# EAGLE design Sensore di allagamento (EAGLE 7.6.0)
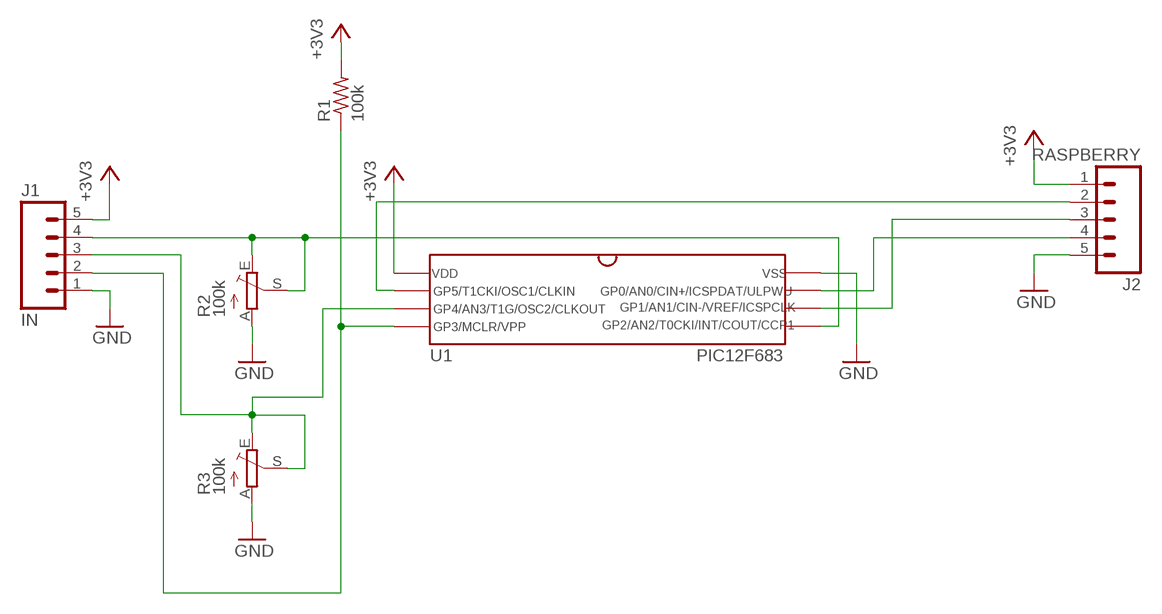
[diagram p0: schematic, sheet 1]

## Parts
J1  IN  M05JST-VERT  [JST-5-PTH-VERT]
J2  RASPBERRY  M05PTH  [1X05]
R1  100k  R-US_0207/15  [0207/15]
R2  100k  TRIM_EU-CA9V  [CA9V]
R3  100k  TRIM_EU-CA9V  [CA9V]
U1  PIC12F683_RPDIP  [RPDIP-8PIN]

## Nets
+3V3: J1.5 J2.1 R1.2 U1.P$1
GND: J1.1 J2.5 R2.A R3.A U1.P$8
N$1: J1.4 R2.E R2.S U1.P$5
N$2: J2.4 U1.P$7
N$3: J2.2 U1.P$2
N$4: J2.3 U1.P$6
N$5: J1.2 R1.1 U1.P$4
N$6: J1.3 R3.E R3.S U1.P$3

## Library data of the parts
J1 J2 = SparkFun-Connectors:M05: Header 5 Standard 5-pin 0.1" header. Use with straight break away headers (SKU : PRT-00116), right angle break away headers (PRT-00553), swiss pins (PRT-00743), machine pins (PRT-00117), and female headers (PRT-00115). Molex polarized connector foot print use with SKU : PRT-08230 with associated crimp pins and housings.
R1 = resistor:R-US_: RESISTOR, American symbol
R2 R3 = pot:TRIM_EU-: POTENTIOMETER
U1 = Luca:PIC12F683

## Board
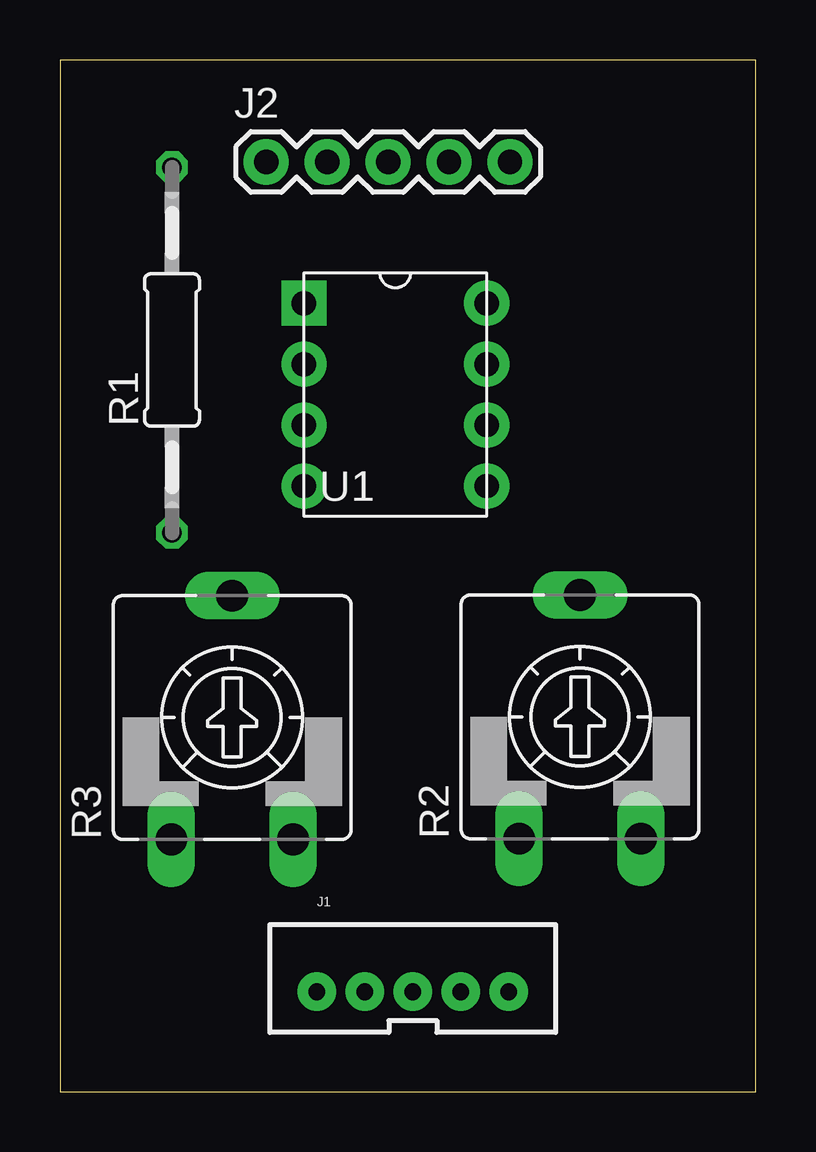
[diagram p1: board, top side]
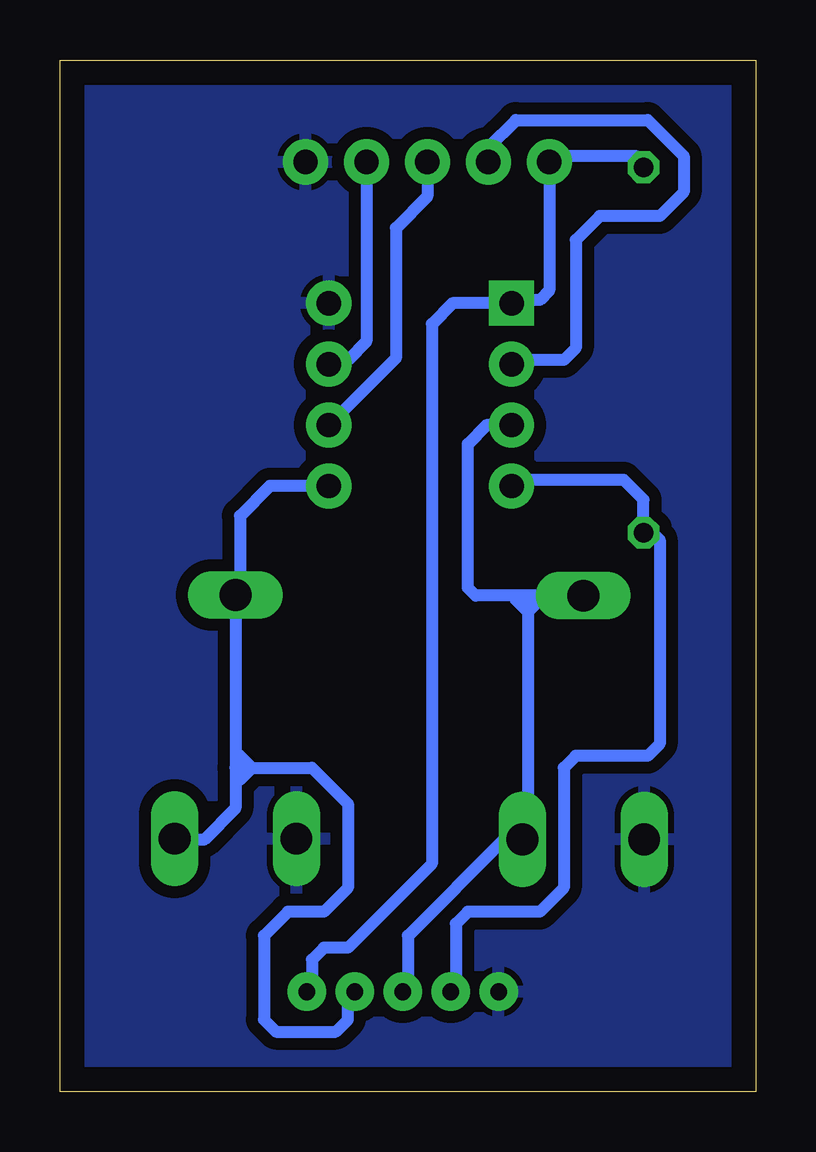
[diagram p2: board, bottom side, seen from below]

Size 29 x 43 mm. Coordinates in mm from the lower left corner, seen from the top.
Outline: 0,0 29,0 29,43 0,43 0,0
Copper layers (1*16): Top 0.035mm / dielectric 1.5mm / Bottom 0.035mm
Design rules "default *": minimum track width 0.5mm, minimum drill 24mil, track to track 0.5mm, track to pad 0.3mm, pad to pad 0.3mm, via to via 0.3mm, smd to smd 8mil, copper to edge 40mil, drill to drill 8mil, minimum pad ring 10mil, minimum via ring 8mil, stop-mask expansion 4mil, vias tented up to drill 0mil, thermal gap 10mil

### Footprints (pad centres in the part's own frame; a part is rotated, then mirrored left to right if it is on the bottom)
JST-5-PTH-VERT = drill 0.7 pad 1.6: 1 -4,0.18; 2 -2,0.18; 3 0,0.18; 4 2,0.18; 5 4,0.18
1X05 = drill 1.016 pad 1.88: 1 0,0; 2 2.54,0; 3 5.08,0; 4 7.62,0; 5 10.16,0
0207/15 = drill 0.813 octagon: 1 -7.62,0; 2 7.62,0
CA9V = drill 1.321 long: A -2.54,-5.08; E 2.54,-5.08; S 0,5.08
RPDIP-8PIN = drill 1.016 pad 1.88 square: P$1 -3.81,3.81 | drill 1.016 pad 1.88: P$2 -3.81,1.27; P$3 -3.81,-1.27; P$4 -3.81,-3.81; P$5 3.81,-3.81; P$6 3.81,-1.27; P$7 3.81,1.27; P$8 3.81,3.81

### Placement (x,y rotation side)
J1  14.71,3.98 0 top
J2  8.6,38.75 0 top
R1  4.67,30.91 90 top
R2  21.68,15.62 0 top
R3  7.18,15.59 0 top
U1  13.98,29.05 0 top

### Tracks (layer width: path | path; a pad name or v marks a point on that pad's centre or on a via)
+3V3
  Bottom 0.5: R1.2 4.67,38.67 5,39 8.35,39 J2.1 8.6,33.4 9,33 10.03,33 U1.P$1 12.64,32.86 13.5,32 13.5,9.5 17,6 18,6 18.5,5.5 18.5,4.37 J1.5
GND
  pour Bottom: 0,43 29,43 29,0 0,0
N$1
  Bottom 0.5: U1.P$5 20.26,25.24 21.5,24 21.5,20.88 R2.S 21.68,13.5 | 21.68,13.5 21.68,11.82 23,10.5 24.18,10.5 R2.E | 21,13.5 21.68,13.5 | 21,13.5 21.5,13 | 21,13.5 21.5,14 | 21,13.5 18.5,13.5 17,12 17,8.5 18,7.5 19.5,7.5 20.5,6.5 20.5,3 20,2.5 17.5,2.5 17,3 17,3.87 J1.4
N$2
  Bottom 0.5: J2.4 16.22,31.28 17,30.5 17.61,30.5 U1.P$7
N$3
  Bottom 0.5: J2.2 11.14,39.36 10,40.5 4.5,40.5 3,39 3,37.5 4,36.5 6.5,36.5 7.5,35.5 7.5,31 8,30.5 9.99,30.5 U1.P$2
N$4
  Bottom 0.5: J2.3 13.68,37.32 15,36 15,30.57 U1.P$6
N$5
  Bottom 0.5: U1.P$4 9.91,25.5 5.5,25.5 4.67,24.67 R1.1 4.29,23.29 4,23 4,14.5 4.5,14 7.5,14 8,13.5 8,8.5 9,7.5 12,7.5 12.5,7 12.5,4.37 J1.2
N$6
  Bottom 0.5: 9.5,20.67 9.5,20 | 9.5,20 9.5,10.73 R3.E 10.49,10.51 14.5,6.5 14.5,4.37 J1.3 | U1.P$3 11.22,27.78 12,27 12,21 11.67,20.67 9.5,20.67 | R3.S 9.5,20.67 | 9,20.5 9.5,20 | 9.5,20 10,20.5